# Altium schematic sheet Digital Camera.SchDoc
size A4; SheetSize: A4 P
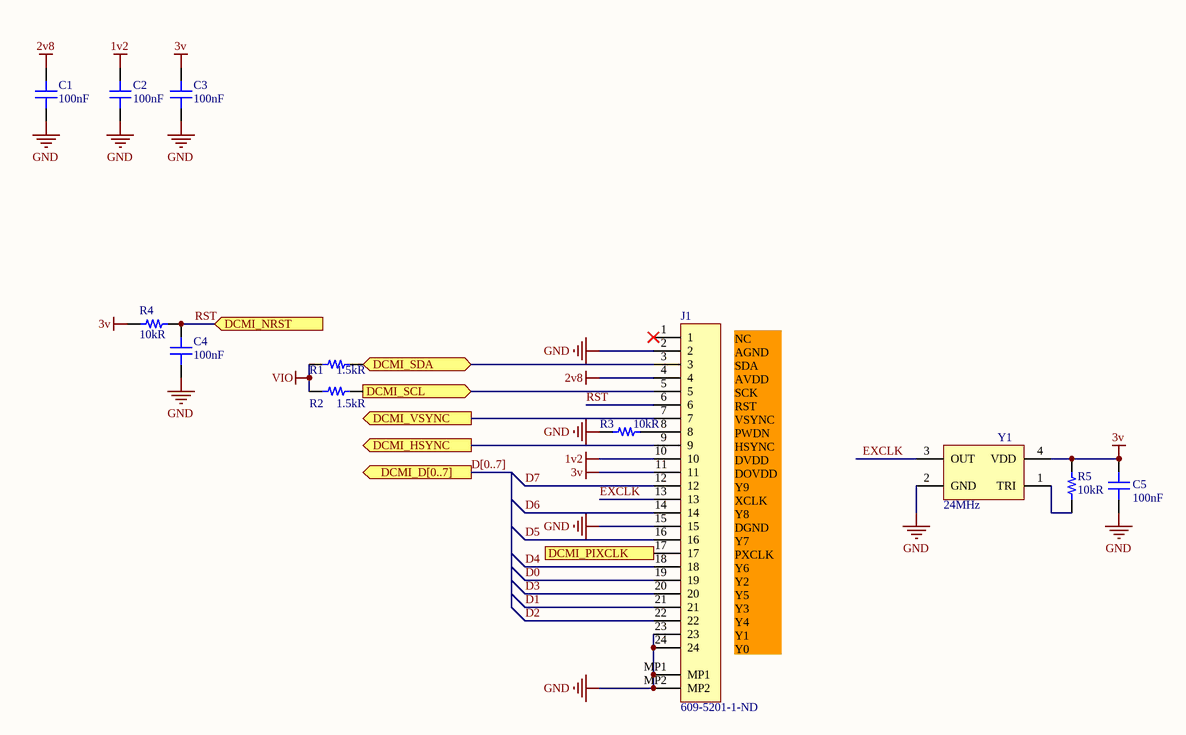
[diagram p0: Digital Camera.SchDoc]

## Parts
C1  100nF  [CAP 0603/1608]
C2  100nF  [CAP 0603/1608]
C3  100nF  [CAP 0603/1608]
C4  100nF  [CAP 0603/1608]
C5  100nF  [CAP 0603/1608]
J1  Supplier Part Number 1: 609-5201-1-ND  [Amphenol SFV24R-1STE1HLF]  (hidden comment: SFV24R-3STBE1HLF)
R1  1.5kR  [RES 0603/1608]
R2  1.5kR  [RES 0603/1608]
R3  10kR  [RES 0603/1608]
R4  10kR  [RES 0603/1608]
R5  10kR  [RES 0603/1608]
Y1  24MHz  [Abracon ASTX-11]

## Ports
DCMI_D[0..7] (out), DCMI_HSYNC (out), DCMI_NRST (in), DCMI_PIXCLK (out), DCMI_SCL (in), DCMI_SDA (bidir), DCMI_VSYNC (out)

## Nets
1v2: C2.2 J1.10
2v8: C1.2 J1.4
3v: C3.2 C5.2 J1.11 R4.2 R5.1 Y1.4(VDD)
GND: C1.1 C2.1 C3.1 C4.1 C5.1 J1.2 J1.15 J1.23 J1.24 J1.MP1 J1.MP2 R3.1 Y1.2(GND)
VIO: R1.2 R2.2
D0: J1.19
D1: J1.21
D2: J1.22
D3: J1.20
D4: J1.18
D5: J1.16
D6: J1.14
D7: J1.12
DCMI_HSYNC: J1.9 ; port DCMI_HSYNC
DCMI_PIXCLK: J1.17 ; port DCMI_PIXCLK
DCMI_SCL: J1.5 R2.1 ; port DCMI_SCL
DCMI_SDA: J1.3 R1.1 ; port DCMI_SDA
DCMI_VSYNC: J1.7 ; port DCMI_VSYNC
EXCLK: J1.13 Y1.3(OUT)
RST: C4.2 J1.6 R4.1 ; port DCMI_NRST
NetJ1_8: J1.8 R3.2
NetR5_2: R5.2 Y1.1(TRI)

Not connected (* = marked no-connect by the designer): J1 1*

## Buses and harness runs
bus D[0..7] = port DCMI_D[0..7]

## Notes on the sheet
- NC
  AGND
  SDA
  AVDD
  SCK
  RST
  VSYNC
  PWDN
  HSYNC
  DVDD
  DOVDD
  Y9
  XCLK
  Y8
  DGND
  Y7
  PXCLK
  Y6
  Y2
  Y5
  Y3
  Y4
  Y1
  Y0
- Title:
- Size:
- Project:
- Revision:
- Sheet
- of
- Date:
- YıLDıZ IoT
- Elperek Mahallesi
- Saray Sokak, No:12
- SAKARYA / TURKEY
- File:

## Library data of the parts
C1-C5 = Capacitor - Ceramic: Ceramic, SMT Capacitor; Manufacturer: Samsung; Manufacturer Part Number: CL10B104JB8NNNC; Tolerance: 5%; Voltage Rating: 50V; Dielectric: X7R; Supplier 1: Digi-Key; Supplier Part Number 1: 1276-1033-1-ND; Stock 1: 223594; Pricing 1: 1 = 0,10000, 10 = 0,05300, 100 = 0,02350, 500 = 0,01680, 1000 = 0,01320 (USD); RoHS: Yes; Mount: Surface Mount; Case/Package: 0603; Case Code (Metric): 1608; Case Code (Imperial): 0603; Material: Ceramic; Contact Plating: Tin; Min Operating Temperature: -55°C; Max Operating Temperature: 125°C; Packaging: Tape and Reel; Package Quantity: 1; Capacitance: 100nF; Voltage: 50V; Length: 1.6mm; Height: 0.8mm; Width: 0.031inch; Thickness: 0.035inch; Depth: 0.8mm; Radiation Hardening: No; ComponentLink1URL: https://media.digikey.com/pdf/Data%20Sheets/Samsung%20PDFs/CL_Series_MLCC_ds.pdf?src-supplier=Digi-Key; ComponentLink1Description: https://media.digikey.com/pdf/Data%20Sheets/Samsung%20PDFs/CL_Series_MLCC_ds.pdf?src-supplier=Digi-Key; ComponentLink2URL: https://www.verical.com/server-webapp/html/getDatasheet?partID=359321&src-supplier=Verical; ComponentLink2Description: https://www.verical.com/server-webapp/html/getDatasheet?partID=359321&src-supplier=Verical; ComponentLink3URL: http://www1.futureelectronics.com/doc/SAMSUNG/CL10B104JB8NNNC.pdf?src-supplier=Future+Electronics; ComponentLink3Description: http://www1.futureelectronics.com/doc/SAMSUNG/CL10B104JB8NNNC.pdf?src-supplier=Future+Electronics; ComponentLink4URL: https://produktinfo.conrad.com/datenblaetter/450000-474999/456613-da-01-en-VS_KONDENSATOR_0603.pdf?src-supplier=Conrad; ComponentLink4Description: https://produktinfo.conrad.com/datenblaetter/450000-474999/456613-da-01-en-VS_KONDENSATOR_0603.pdf?src-supplier=Conrad
J1 = FPC-24: Connector; Manufacturer: Amphenol FCI; Actuator Material: Glass,Polyphenylene; Voltage Rating: 50V; Current Rating: 500mA; Number of Positions: 24; Contact Location: Bottom; Insulation Resistance: 100MR; Pitch: 0.02inch; ComponentLink1URL: http://portal.fciconnect.com/Comergent//fci/drawing/10116954.pdf?src-supplier=Digi-Key; ComponentLink1Description: http://portal.fciconnect.com/Comergent//fci/drawing/10116954.pdf?src-supplier=Digi-Key; ComponentLink2URL: https://cdn.amphenol-icc.com/media/wysiwyg/files/drawing/10116954.pdf?src-supplier=Digi-Key; ComponentLink2Description: https://cdn.amphenol-icc.com/media/wysiwyg/files/drawing/10116954.pdf?src-supplier=Digi-Key; Supplier 1: Digi-Key; Manufacturer Part Number: SFV24R-3STBE1HLF; Stock 1: 4525; Pricing 1: 1 = 0,51000, 10 = 0,48200, 25 = 0,43400, 50 = 0,38580, 100 = 0,36960, 250 = 0,33748, 500 = 0,32142, 1000 = 0,26517 (USD); RoHS: Yes; Mount: Surface Mount; Contact Material: Bronze; Contact Plating: Gold; Housing Material: Polymer; Min Operating Temperature: -55°C; Max Operating Temperature: 105°C; Package Quantity: 6000; Packaging: Tape and Reel; Termination: Solder; Flammability Rating: UL94 V-0
R1 R2 = Resistor_Chip: Ceramic, SMT Capacitor; Manufacturer: Yageo; Manufacturer Part Number: RC0603FR-071K5L; Tolerance: 1%; Voltage Rating (DC): 50V; Temperature Coefficient: 100ppm/°C; Power Rating: 100mW; Supplier 1: Digi-Key; Supplier Part Number 1: 311-1.50KHRCT-ND; Stock 1: 4073514; Pricing 1: 1 = 0,10000, 10 = 0,02300, 100 = 0,00940, 1000 = 0,00421, 2500 = 0,00366 (USD); RoHS: Yes; Case/Package: 0603; Number of Pins: 2; Case Code (Metric): 1608; Case Code (Imperial): 0603; Min Operating Temperature: -55°C; Max Operating Temperature: 155°C; Packaging: Tape and Reel; Resistance: 1.5kR; Composition: Thick Film; Voltage Rating: 50V; Number of Terminations: 2; Termination: SMD/SMT; Military Standard: Not; Package Quantity: 1; Features: Moisture Resistant; Max Power Dissipation: 100mW; Length: 0.063inch; Height: 0.022inch; Width: 0.031inch; Depth: 0.8mm; REACH SVHC: No SVHC; Lead Free: Lead Free; ComponentLink1URL: https://datasheet.ciiva.com/2454/pyu-r-int-thick-7-2454513.pdf?src-supplier=Digi-Key; ComponentLink1Description: https://datasheet.ciiva.com/2454/pyu-r-int-thick-7-2454513.pdf?src-supplier=Digi-Key; ComponentLink2URL: https://datasheet.ciiva.com/2454/pyu-r-int-thick-7-2454514.pdf?src-supplier=Digi-Key; ComponentLink2Description: https://datasheet.ciiva.com/2454/pyu-r-int-thick-7-2454514.pdf?src-supplier=Digi-Key; ComponentLink3URL: https://datasheet.ciiva.com/2454/pyu-r-int-thick-7-2454515.pdf?src-supplier=Digi-Key; ComponentLink3Description: https://datasheet.ciiva.com/2454/pyu-r-int-thick-7-2454515.pdf?src-supplier=Digi-Key; ComponentLink4URL: https://datasheet.ciiva.com/46440/1868787-46440895.pdf?src-supplier=Element14; ComponentLink4Description: https://datasheet.ciiva.com/46440/1868787-46440895.pdf?src-supplier=Element14
R3-R5 = Resistor_Chip: Ceramic, SMT Capacitor; Manufacturer: Stackpole Electronics; Manufacturer Part Number: RNCP0603FTD10K0; Tolerance: 1%; Max Power Dissipation: 125mW; Temperature Coefficient: 100ppm/°C; Supplier 1: Digi-Key; Supplier Part Number 1: RNCP0603FTD10K0CT-ND; Stock 1: 183083; Pricing 1: 1 = 0,10000, 10 = 0,06700, 100 = 0,02730, 1000 = 0,01224, 2500 = 0,01063 (USD); RoHS: Yes; Mount: Surface Mount; Case/Package: 0603; Case Code (Metric): 1608; Case Code (Imperial): 0603; Contact Plating: Matte,Tin; Min Operating Temperature: -55°C; Max Operating Temperature: 155°C; Packaging: Tape and Reel; Resistance: 10kR; Composition: Thin Film; Number of Terminations: 2; Features: Anti-Sulfur,Moisture Resistant; Length: 0.059inch; Height: 0.02inch; Width: 0.031inch; Radiation Hardening: No; Lead Free: Lead Free
Y1 = ASD1-1.544MHZ-EC-T: OSC XO 1.544MHZ CMOS SMD; Manufacturer: ECS Inc.; Manufacturer Part Number: ECS-3225MV-240-CN-TR; Base Resonator: Crystal; Function: Enable/Disable; Output: HCMOS; Voltage - Supply: 1.62V ~ 3.63V; Frequency Stability: ±25ppm; ComponentLink1Description: Datasheet; ComponentLink1URL: http://www.abracon.com/Oscillators/ASDseries.pdf; ComponentLink2Description: Digi-Key Listing; ComponentLink2URL: https://www.digikey.com/product-detail/en/ASD1-1.544MHZ-EC-T/535-9579-2-ND/1236896; Supplier 1: Digi-Key; Supplier Part Number 1: XC2884CT-ND; Stock 1: 1655; Pricing 1: 1 = 0,92000, 10 = 0,81700, 50 = 0,76380, 100 = 0,67510, 500 = 0,63954 (USD); RoHS: No; ComponentLink3URL: https://www.ecsxtal.com/store/pdf/ECS-3225MV.pdf?src-supplier=Digi-Key; ComponentLink3Description: https://www.ecsxtal.com/store/pdf/ECS-3225MV.pdf?src-supplier=Digi-Key; Packaging: Cut Tape (CT); Type: XO (Standard); Frequency: 24MHz; Series: ECS-3225MV